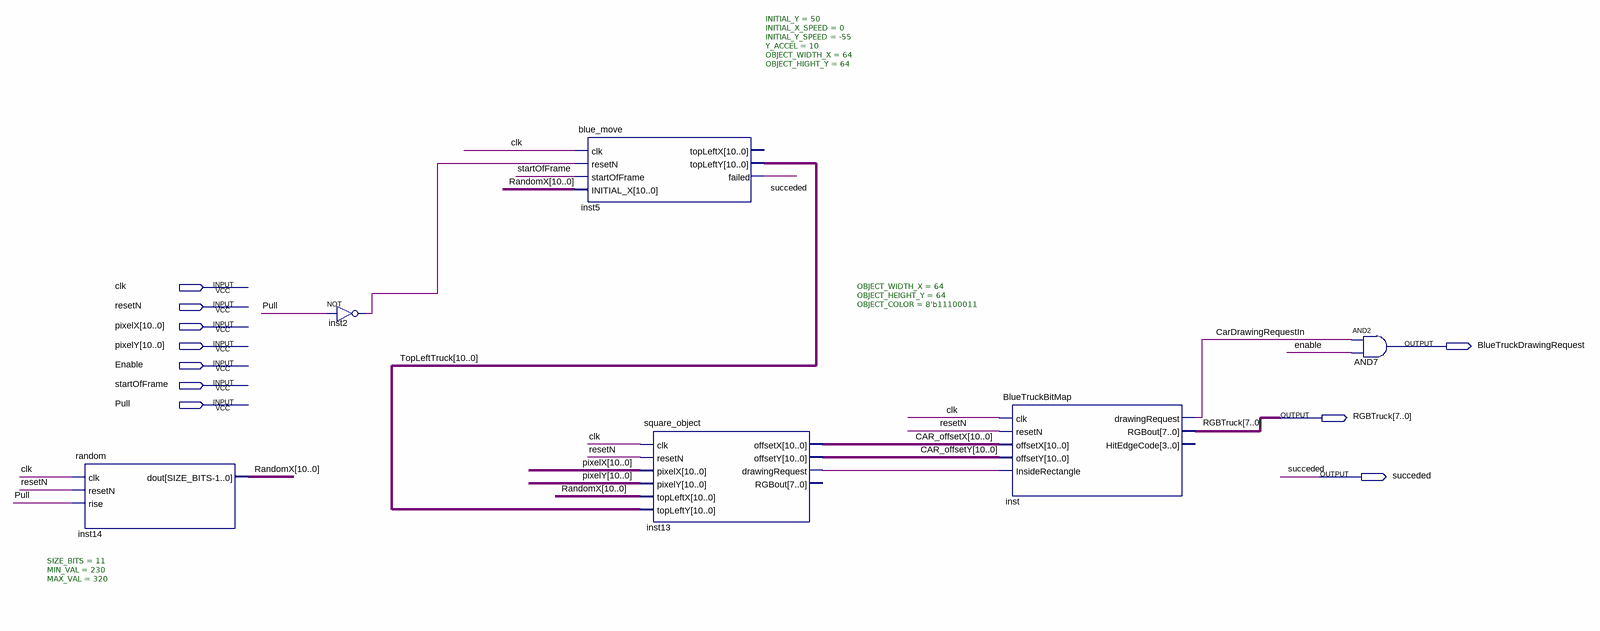
[diagram p0: schematic sheet]
// Quartus schematic BlueTruckDisplay.bdf as structural Verilog: 6 symbols, 10 pins
module BlueTruckDisplay (
  input  clk,
  input  resetN,
  input  [10:0] pixelX,
  input  [10:0] pixelY,
  input  Enable,
  input  startOfFrame,
  input  Pull,
  output BlueTruckDrawingRequest,
  output [7:0] RGBTruck,
  output succeded
);

  wire CarDrawingRequestIn, inst2_out, inst13_drawingrequest;
  wire [10:0] CAR_offsetX, CAR_offsetY, RandomX, TopLeftTruck;

  random #(.SIZE_BITS(11), .MIN_VAL(230), .MAX_VAL(320)) inst14 (
    .clk(clk), .resetN(resetN), .rise(Pull), .dout(RandomX));
  not inst2 (inst2_out, Pull);
  blue_move #(.INITIAL_Y(50), .INITIAL_X_SPEED(0), .INITIAL_Y_SPEED(-55), .Y_ACCEL(10), .OBJECT_WIDTH_X(64), .OBJECT_HIGHT_Y(64)) inst5 (
    .clk(clk), .resetN(inst2_out), .startOfFrame(startOfFrame), .INITIAL_X(RandomX), .topLeftY(TopLeftTruck),
    .failed(succeded));  // open: topLeftX
  square_object #(.OBJECT_WIDTH_X(64), .OBJECT_HEIGHT_Y(64), .OBJECT_COLOR(8'b11100011)) inst13 (
    .clk(clk), .resetN(resetN), .pixelX(pixelX), .pixelY(pixelY), .topLeftX(RandomX),
    .topLeftY(TopLeftTruck), .offsetX(CAR_offsetX), .offsetY(CAR_offsetY),
    .drawingRequest(inst13_drawingrequest));  // open: RGBout
  BlueTruckBitMap inst (
    .clk(clk), .resetN(resetN), .offsetX(CAR_offsetX), .offsetY(CAR_offsetY),
    .InsideRectangle(inst13_drawingrequest), .drawingRequest(CarDrawingRequestIn), .RGBout(RGBTruck));  // open: HitEdgeCode
  and AND7 (BlueTruckDrawingRequest, CarDrawingRequestIn, Enable);
endmodule
